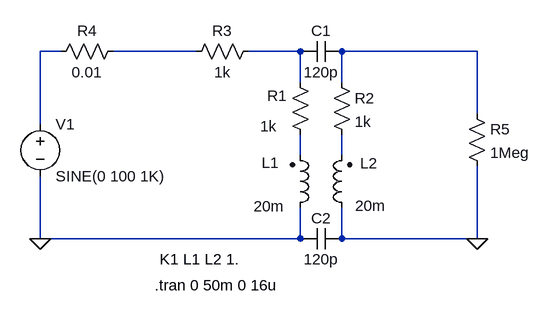
[diagram p0: schematic Transformador.asc]
Transformador.asc, the LTspice schematic file:
Version 4
SHEET 1 880 680
WIRE -272 -32 -304 -32
WIRE -64 -32 -192 -32
WIRE 96 -32 16 -32
WIRE 368 -32 160 -32
WIRE 96 16 96 -32
WIRE 160 16 160 -32
WIRE 368 64 368 -32
WIRE -304 80 -304 -32
WIRE 96 128 96 96
WIRE 160 128 160 96
WIRE -304 256 -304 160
WIRE 96 256 96 208
WIRE 96 256 -304 256
WIRE 160 256 160 208
WIRE 368 256 368 144
WIRE 368 256 160 256
FLAG 368 256 0
FLAG -304 256 0
SYMBOL res 80 0 R0
WINDOW 0 -35 36 Left 2
WINDOW 3 -46 83 Left 2
SYMATTR InstName R1
SYMATTR Value 1k
SYMBOL res 144 0 R0
SYMATTR InstName R2
SYMATTR Value 1k
SYMBOL res 32 -48 R90
WINDOW 0 0 56 VBottom 2
WINDOW 3 32 56 VTop 2
SYMATTR InstName R3
SYMATTR Value 1k
SYMBOL voltage -304 64 R0
WINDOW 123 0 0 Left 0
WINDOW 39 24 124 Left 2
SYMATTR InstName V1
SYMATTR Value SINE(0 100 1K)
SYMBOL ind2 176 224 R180
WINDOW 0 112 85 Left 2
WINDOW 3 -52 19 Left 2
SYMATTR InstName L1
SYMATTR Value 20m
SYMBOL ind2 80 224 M180
WINDOW 0 108 84 Left 2
WINDOW 3 -56 18 Left 2
SYMATTR InstName L2
SYMATTR Value 20m
SYMBOL res -176 -48 R90
WINDOW 0 0 56 VBottom 2
WINDOW 3 32 56 VTop 2
SYMATTR InstName R4
SYMATTR Value 0.01
SYMBOL res 352 48 R0
SYMATTR InstName R5
SYMATTR Value 1Meg
SYMBOL cap 160 -48 R90
WINDOW 0 0 32 VBottom 2
WINDOW 3 32 32 VTop 2
SYMATTR InstName C1
SYMATTR Value 120p
SYMBOL cap 160 240 R90
WINDOW 0 0 32 VBottom 2
WINDOW 3 32 32 VTop 2
SYMATTR InstName C2
SYMATTR Value 120p
TEXT -128 328 Left 2 !.tran 0 50m 0 16u
TEXT -120 288 Left 2 !K1 L1 L2 1.

The netlist it stands for:
* Transformador.asc
R1 N003 N005 1k
R2 N004 N006 1k
R3 N003 N002 1k
V1 N001 0 SINE(0 100 1K)
L1 0 N006 20m
L2 0 N005 20m
R4 N002 N001 0.01
R5 N004 0 1Meg
C1 N004 N003 120p
C2 0 0 120p
.tran 0 50m 0 16u
K1 L1 L2 1.
.backanno
.end